# Altium schematic sheet Ethernet.schdoc
size A4
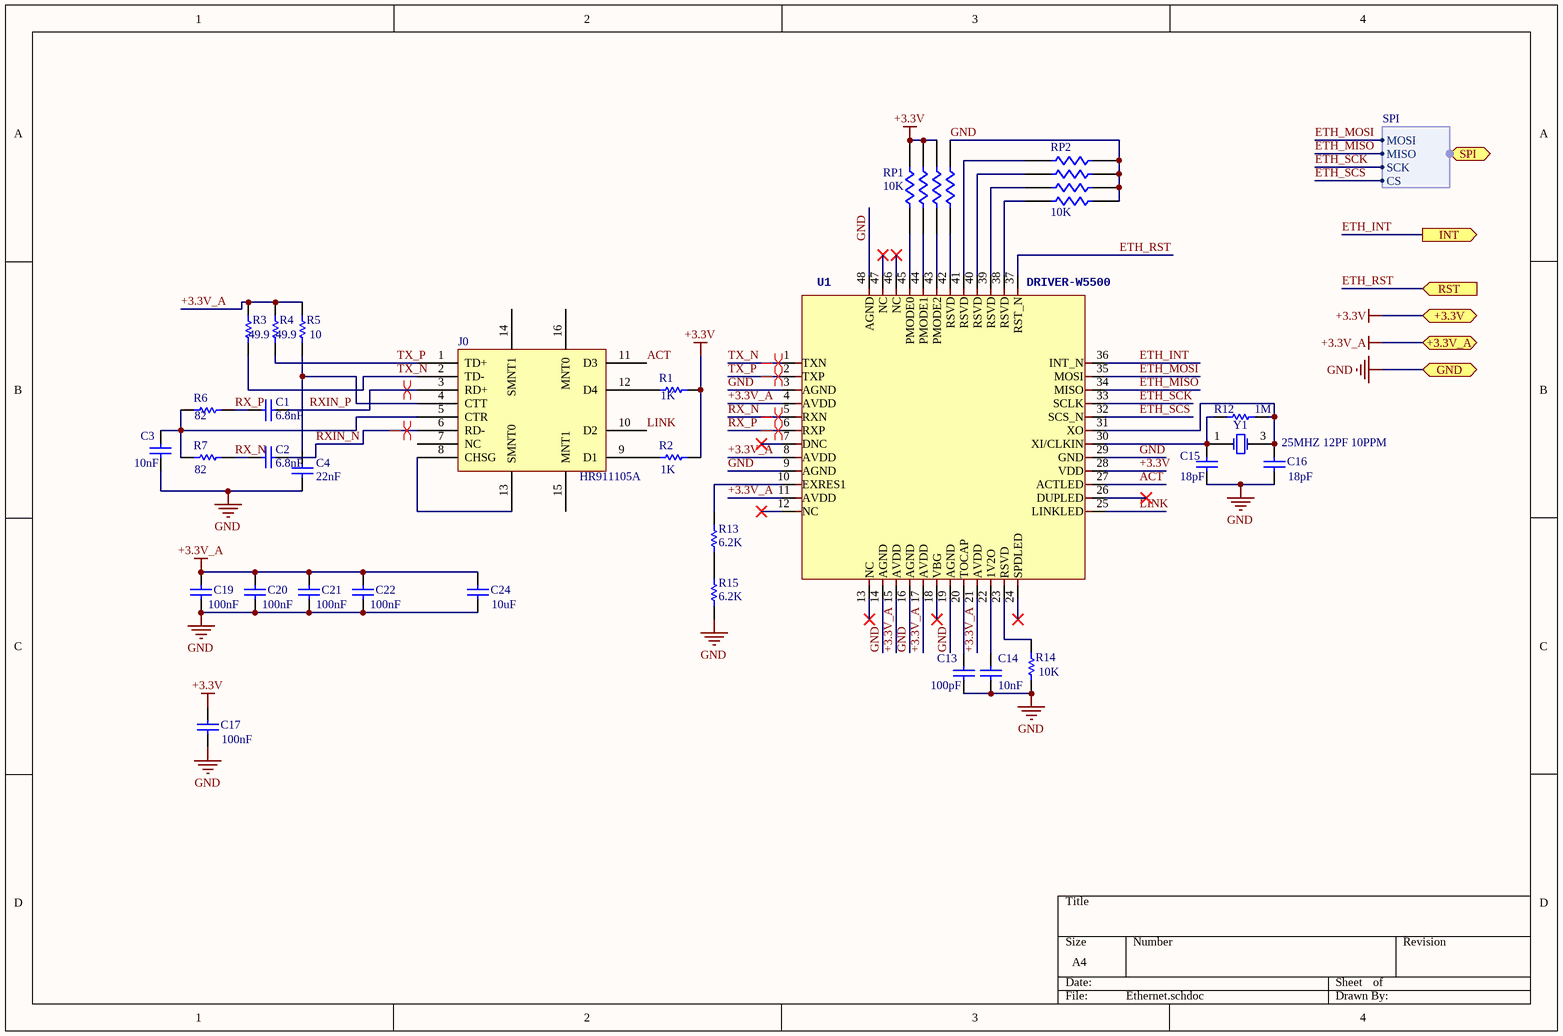
[diagram p0: Ethernet.schdoc]

## Parts
C1  value 6.8nF  [C-1608[0603]]
C2  value 6.8nF  [C-1608[0603]]
C3  value 10nF  [C-1608[0603]]
C4  value 22nF  [C-1608[0603]]
C13  value 100pF  [C-1608[0603]]
C14  value 10nF  [C-1608[0603]]
C15  value 18pF  [C-1608[0603]]
C16  value 18pF  [C-1608[0603]]
C17  value 100nF  [C-1608[0603]]
C19  value 100nF  [C-1608[0603]]
C20  value 100nF  [C-1608[0603]]
C21  value 100nF  [C-1608[0603]]
C22  value 100nF  [C-1608[0603]]
C24  value 10uF  [C-1608[0603]]
J0  HR911105A  [RJ45-8P8C]
R1  value 1K  [R-1608[0603]]
R2  value 1K  [R-1608[0603]]
R3  value 49.9  [R-1608[0603]]
R4  value 49.9  [R-1608[0603]]
R5  value 10  [R-1608[0603]]
R6  value 82  [R-1608[0603]]
R7  value 82  [R-1608[0603]]
R12  value 1M  [R-1608[0603]]
R13  value 6.2K  [R-1608[0603]]
R14  value 10K  [R-1608[0603]]
R15  value 6.2K  [R-1608[0603]]
RP1  10K  [R0603x4]
RP2  10K  [R0603x4]
U1  DRIVER-W5500  [TQFP48_N]
Y1  25MHZ 12PF 10PPM  [XT_3225_4]

## Ports
+3.3V, +3.3V_A, GND, INT (out), RST (in), SPI (harness SPI)

## Harnesses
SPI: MOSI, MISO, SCK, CS

## Nets
+3.3V: C17.2 R1.2 R2.2 RP1.6 RP1.7 RP1.8 U1.28(VDD) ; port +3.3V
+3.3V_A: C19.2 C20.2 C21.2 C22.2 C24.2 R3.2 R4.2 R5.2 U1.4(AVDD) U1.8(AVDD) U1.11(AVDD) U1.15(AVDD) U1.17(AVDD) U1.21(AVDD) ; port +3.3V_A
GND: C3.1 C4.1 C13.1 C14.1 C15.1 C16.1 C17.1 C19.1 C20.1 C21.1 C22.1 C24.1 R14.2 R15.2 RP1.5 RP2.5 RP2.6 RP2.7 RP2.8 U1.3(AGND) U1.9(AGND) U1.14(AGND) U1.16(AGND) U1.19(AGND) U1.29(GND) U1.48(AGND) ; port GND
ACT: J0.11(D3) U1.27(ACTLED)
ETH_INT: U1.36(INT_N) ; port INT
ETH_MISO: U1.34(MISO) ; port SPI.MISO
ETH_MOSI: U1.35(MOSI) ; port SPI.MOSI
ETH_RST: U1.37(RST_N) ; port RST
ETH_SCK: U1.33(SCLK) ; port SPI.SCK
ETH_SCS: U1.32(SCS_N) ; port SPI.CS
LINK: J0.10(D2) U1.25(LINKLED)
RX_N: C2.1 R7.2 U1.5(RXN)
RX_P: C1.1 R6.2 U1.6(RXP)
RXIN_N: C2.2 J0.6(RD-)
RXIN_P: C1.2 J0.3(RD+)
TX_N: J0.2(TD-) R3.1 U1.1(TXN)
TX_P: J0.1(TD+) R4.1 U1.2(TXP)
NetC3_2: C3.2 J0.5(CTR) R6.1 R7.1
NetC4_2: C4.2 J0.4(CTT) R5.1
NetC13_2: C13.2 U1.20(TOCAP)
NetC14_2: C14.2 U1.22(1V2O)
NetC15_2: C15.2 R12.1 U1.30(XI/CLKIN) Y1.1(OSC1)
NetC16_2: C16.2 R12.2 U1.31(XO) Y1.3(OSC2)
NetJ0_8: J0.8(CHSG) J0.13(SMNT0)
NetJ0_9: J0.9(D1) R2.1
NetJ0_12: J0.12(D4) R1.1
NetR13_1: R13.1 U1.10(EXRES1)
NetR13_2: R13.2 R15.1
NetR14_1: R14.1 U1.23(RSVD)
NetRP1_1: RP1.1 U1.45(PMODE0)
NetRP1_2: RP1.2 U1.44(PMODE1)
NetRP1_3: RP1.3 U1.43(PMODE2)
NetRP1_4: RP1.4 U1.42(RSVD)
NetRP2_1: RP2.1 U1.41(RSVD)
NetRP2_2: RP2.2 U1.40(RSVD)
NetRP2_3: RP2.3 U1.39(RSVD)
NetRP2_4: RP2.4 U1.38(RSVD)

Not connected (* = marked no-connect by the designer): J0 7(NC) 14(SMNT1) 15(MNT1) 16(MNT0); U1 7(DNC)* 12(NC)* 13(NC)* 18(VBG)* 24(SPDLED)* 26(DUPLED)* 46(NC)* 47(NC)*

## Layout directives
differential pair: RX_N, RX_P, RXIN_N, RXIN_P, TX_N, TX_P

## Library data of the parts
C1-C4 C13-C17 C19-C22 C24 = Cap Semi: Capacitor (Semiconductor SIM Model); Published: 8-Jun-2000; LatestRevisionDate: 29-May-2009; LatestRevisionNote: IPC-7351 Footprint Added.; Publisher: Altium Limited; PackageDescription: Chip Capacitor
  C1-C4 C14-C17 C19-C22 C24: PackageReference: C1206
  C13: PackageReference: 4.7uF
J0 = RJ45INTLED
R1-R7 R12-R15 = Res Semi: Semiconductor Resistor; Published: 8-Jun-2000; LatestRevisionDate: 17-Jul-2002; LatestRevisionNote: Re-released for DXP Platform.; PackageReference: AXIAL-0.5; Publisher: Altium Limited
  R1-R7 R12 R14: PackageDescription: Axial Device, Thru-Hole; 2 Leads; 0.5 in Pin Spacing
RP1 RP2 = RPACK4
Y1 = XTAL: Crystal Oscillator; Published: 8-Jun-2000; LatestRevisionDate: 17-Jul-2002; LatestRevisionNote: Re-released for DXP Platform.; PackageReference: R38; Publisher: Altium Limited; PackageDescription: Crystal, Thru-Hole; 2 Leads; Body 3.1 x 8.2 mm (Dia.xH)